# Altium schematic sheet MCU.SchDoc
size A; SheetNumber: 2; SheetTotal: 4
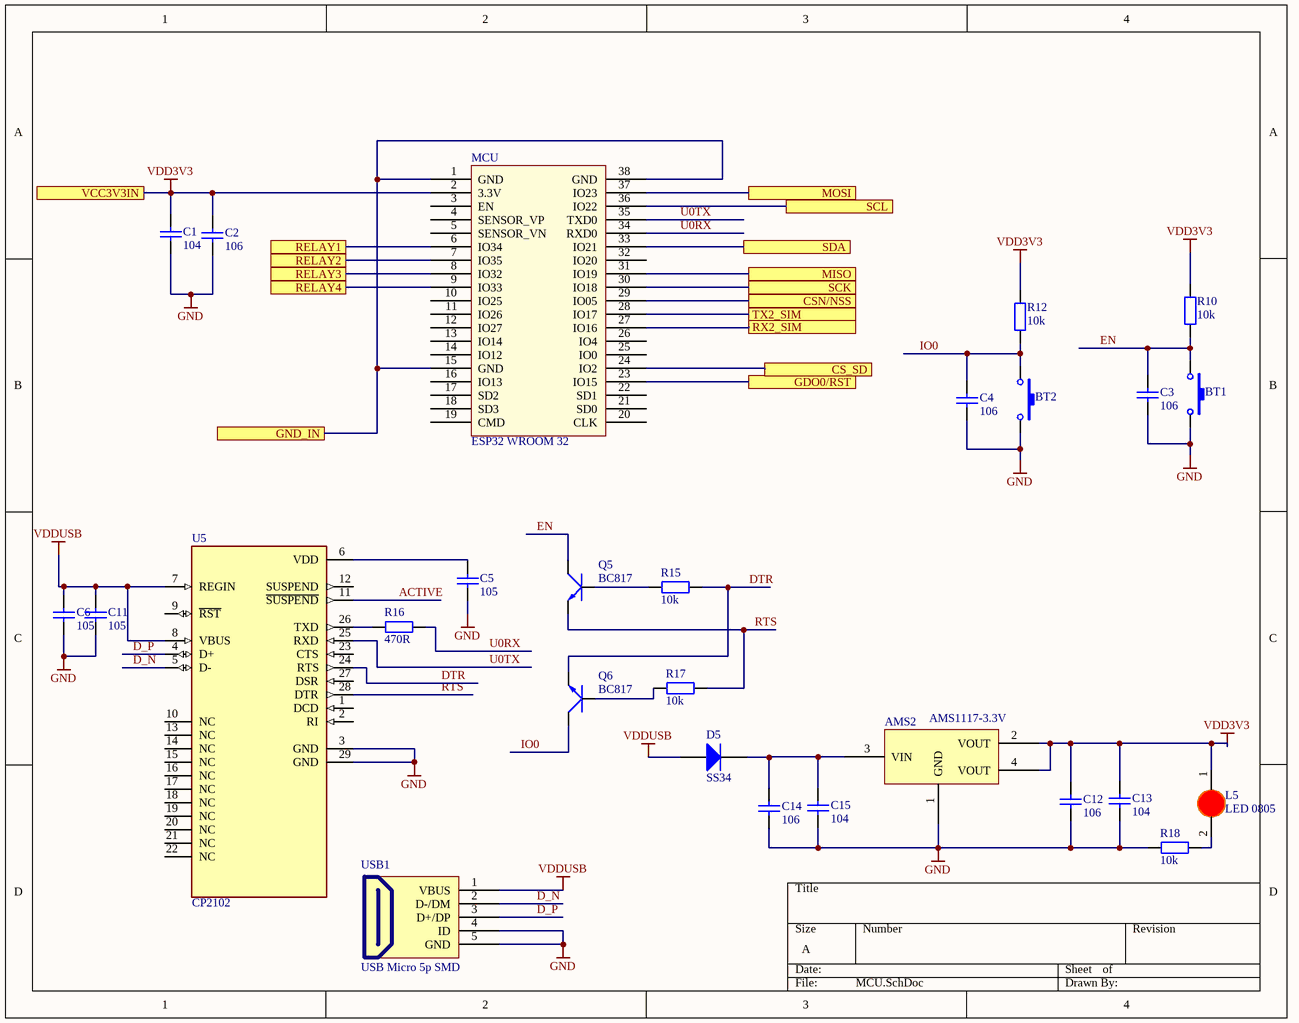
[diagram p0: MCU.SchDoc]

## Parts
AMS2  AMS1117-3.3V  [SOT223]
BT1  Nut Nhan 2 Chan SMD 3x6x2.5  [Nut Nhan 2 Chan SMD 3x6x2.5]  (value not drawn)
BT2  Nut Nhan 2 Chan SMD 3x6x2.5  [Nut Nhan 2 Chan SMD 3x6x2.5]  (value not drawn)
C1  104  [tu 0805]
C2  106  [tu 0805]
C3  106  [tu 0805]
C4  106  [tu 0805]
C5  105  [tu 0805]
C6  105  [tu 0805]
C11  105  [tu 0805]
C12  106  [tu 0805]
C13  104  [tu 0805]
C14  106  [tu 0805]
C15  104  [tu 0805]
D5  SS34  [DIODE SMA]
L5  LED 0805  [LED-0805-Red]
MCU  ESP32 WROOM 32  [ESP32-WROOM-32D]
Q5  BC817  [SOT-23]
Q6  BC817  [SOT-23]
R10  10k  [tro smd 0805]
R12  10k  [tro smd 0805]
R15  10k  [tro smd 0805]
R16  470R  [Tro SMD 0805]
R17  10k  [tro smd 0805]
R18  10k  [tro smd 0805]
U5  CP2102  [QFN50P500X500X100-29N]
USB1  USB Micro 5p SMD  [USB Micro 5p SMD]

## Ports
CS_SD, CSN/NSS, GDO0/RST, GND_IN, MISO, MOSI, RELAY1, RELAY2, RELAY3, RELAY4, RX2_SIM, SCK, SCL, SDA, TX2_SIM, VCC3V3IN

## Nets
GND: AMS2.1(GND) BT1.2 BT2.2 C1.2 C2.2 C3.2 C4.2 C5.2 C6.2 C11.2 C12.2 C13.2 C14.2 C15.2 R18.2 U5.3(GND) U5.29(GND) USB1.4(ID) USB1.5(GND)
VDD3V3: AMS2.2(VOUT) AMS2.4(VOUT) C1.1 C2.1 C12.1 C13.1 L5.1(A) MCU.2(3.3V) R10.2 R12.2 ; port VCC3V3IN
VDDUSB: C6.1 C11.1 D5.1(A) U5.7(REGIN) U5.8(VBUS) USB1.1(VBUS)
ACTIVE: U5.11(~{SUSPEND})
CS_SD: MCU.24(IO2) ; port CS_SD
CSN/NSS: MCU.29(IO05) ; port CSN/NSS
D_N: U5.5(D-) USB1.2(D-/DM)
D_P: U5.4(D+) USB1.3(D+/DP)
DTR: Q6.2(E) R15.2 U5.24(RTS)
EN: BT1.1 C3.1 Q5.3(C) R10.1
GDO0/RST: MCU.23(IO15) ; port GDO0/RST
GND_IN: MCU.1(GND) MCU.15(GND) MCU.38(GND) ; port GND_IN
IO0: BT2.1 C4.1 Q6.3(C) R12.1
MISO: MCU.31(IO19) ; port MISO
MOSI: MCU.37(IO23) ; port MOSI
RELAY1: MCU.6(IO34) ; port RELAY1
RELAY2: MCU.7(IO35) ; port RELAY2
RELAY3: MCU.8(IO32) ; port RELAY3
RELAY4: MCU.9(IO33) ; port RELAY4
RTS: Q5.2(E) R17.2 U5.28(DTR)
RX2_SIM: MCU.27(IO16) ; port RX2_SIM
SCK: MCU.30(IO18) ; port SCK
SCL: MCU.36(IO22) ; port SCL
SDA: MCU.33(IO21) ; port SDA
TX2_SIM: MCU.28(IO17) ; port TX2_SIM
U0RX: MCU.34(RXD0) R16.2
U0TX: MCU.35(TXD0) U5.25(RXD)
NetAMS2_3: AMS2.3(VIN) C14.1 C15.1 D5.2(K)
NetC5_1: C5.1 U5.6(VDD)
NetL5_2: L5.2(K) R18.1
NetQ5_1: Q5.1(B) R15.1
NetQ6_1: Q6.1(B) R17.1
NetR16_1: R16.1 U5.26(TXD)

Not connected (* = marked no-connect by the designer): MCU 3(EN) 4(SENSOR_VP) 5(SENSOR_VN) 10(IO25) 11(IO26) 12(IO27) 13(IO14) 14(IO12) 16(IO13) 17(SD2) 18(SD3) 19(CMD) 20(CLK) 21(SD0) 22(SD1) 25(IO0) 26(IO4) 32(IO20); U5 1(DCD) 2(RI) 9(~{RST}) 10(NC) 12(SUSPEND) 13(NC) 14(NC) 15(NC) 16(NC) 17(NC) 18(NC) 19(NC) 20(NC) 21(NC) 22(NC) 23(CTS) 27(DSR)

## Library data of the parts
AMS2 = AMS1117 SMD: Dán; Value: AMS1117-3.3V SOT223; Don_Vi: Con; Ma_Hang: MH000596; Ghi_Chu: *; Kieu_Chan: *; Chung_Loai: Dán
BT1 BT2 = Nut Nhan 2 Chan SMD 3x6x2.5: Ma_Hang: MH001036; Ten: Nút Nhấn 2 Chân 3x6x2.5MM SMD
C1 C13 C15 = Tu 0805 104 50V 10%: Dán; Don_Vi: Con; So_Chan: 2; Ten_Linh_Kien: Tụ 0805 104-100nF 10% 50V; Ma_Hang: MH004551; Chung_Loai: Dán; Kieu_Chan: *
C2 = Tu 0805 106 16V 10%: Dán; Don_Vi: Con; So_Chan: 2; Ten_Linh_Kien: Tụ 0805 106-10uF 10% 16V; Ma_Hang: MH004553; Chung_Loai: Dán; Kieu_Chan: *
C3 C4 C12 C14 = Tu 0805 106 16V 10%: Dán; Ten_Linh_Kien: Tụ 0805 106-10uF 10% 16V; So_Chan: 2; Don_Vi: Con; Ma_Hang: MH004553; Chung_Loai: Dán; Kieu_Chan: *
C5 C6 C11 = Tu 0805 105 50V 10%: Dán; Don_Vi: Con; So_Chan: 2; Ten_Linh_Kien: Tụ 0805 105-1uF 10% 50V; Ma_Hang: MH004552; Chung_Loai: Dán; Kieu_Chan: *
D5 = Diode SS34 ( 1N5822 ): Dán; Don_Vi: Con; Ma_Hang: MH002104; Ten_Linh_Kien: Diode SS34 3A 40V SMA ( 1N5822 SS34A); Kieu_Chan: *; Chung_Loai: Dán
L5 = LED 0805 Do: Dán; Don_Vi: Con; Ma_Hang: MH000897; Ten_Linh_Kien: LED 0805 Màu Đỏ (Red); Ghi_Chu: *; Kieu_Chan: *; Chung_Loai: Dán
Q5 Q6 = Trans BC817: SOT-23 - C8658; Value: C9014
R10 R12 = Tro 0805 5% 10k: Dán; Don_Vi: Con; So_Chan: 2; Ten_Linh_Kien: Trở 0805 5% 10k; Ma_Hang: MH005239; Chung_Loai: Dán; Kieu_Chan: *
R15 R17 R18 = Tro 0805 1% 10k: Dán; Don_Vi: Con; So_Chan: 2; Ten_Linh_Kien: Trở 0805 1% 10k; Ma_Hang: MH005473; Chung_Loai: Dán; Kieu_Chan: *
R16 = Tro 0805 5% 470R: Dán; Don_Vi: Con; Ma_Hang: MH005341; Ten_Linh_Kien: Trở 0805 5% 470R; So_Chan: 2; Chung_Loai: Dán; Kieu_Chan: *
U5 = CP2102: CP2102N USB 2.0 to UART (RS232) Bridge Interface Evaluation Board; MF: Silicon Labs; Purchase-URL: https://pricing.snapeda.com/search/part/CP2102/?ref=eda; Package: WFQFN-20 Silicon Labs; Value: *; Check_prices: https://www.snapeda.com/parts/CP2102/Silicon+Labs/view-part/?ref=eda; SnapEDA_Link: https://www.snapeda.com/parts/CP2102/Silicon+Labs/view-part/?ref=snap; Availability: In Stock; Price: None; MP: CP2102
USB1 = USB Micro 5p SMD: USB Type B; Ten: MicroUSB MK5P SMD; Ma_Hang: MH001020